# EAGLE design Week05_ElectronicsDesign_ADLL_FabAcademy2014 (EAGLE 6.5.0)
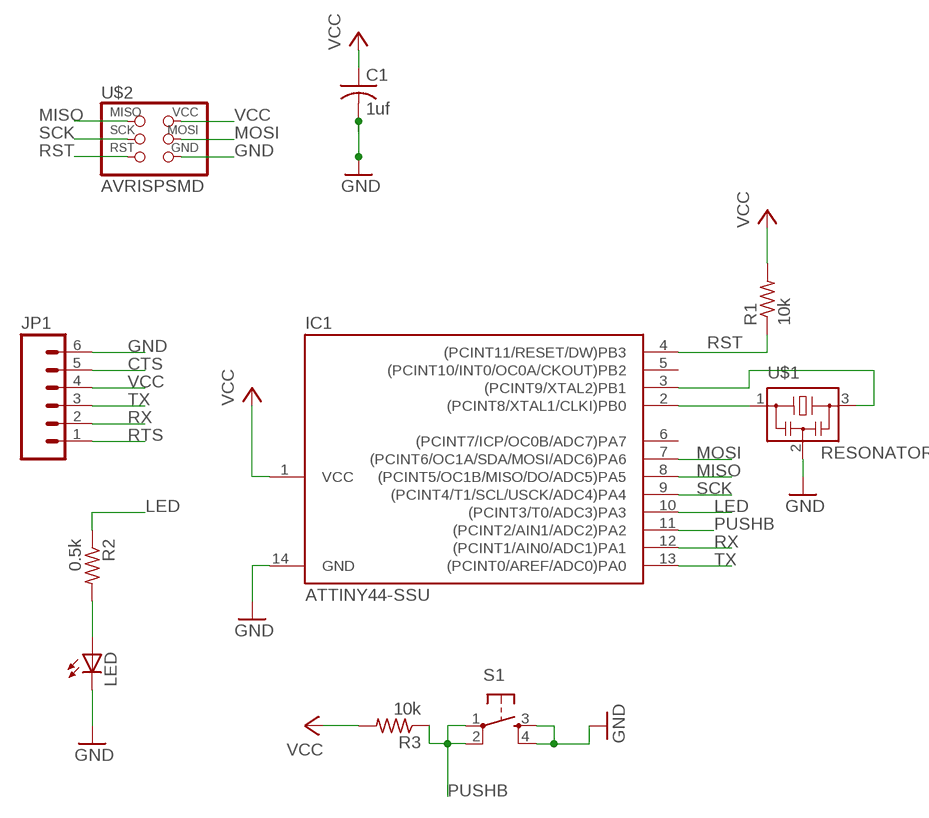
[diagram p0: schematic, sheet 1]

## Parts
C1  1uf  C-USC1206  [C1206]
IC1  ATTINY44-SSU  [SOIC14]
JP1  M06SMD  [1X06-SMD]
LED  LED1206  [1206]
R1  10k  R-US_R1206  [R1206]
R2  0.5k  R-US_R1206  [R1206]
R3  10k  R-US_R1206  [R1206]
S1  6MM_SWITCH6MM_SWITCH  [6MM_SWITCH]
U$1  RESONATOR  [EFOBM]
U$2  AVRISPSMD  [2X03SMD]

## Nets
CTS: JP1.5
GND: C1.2 IC1.14(GND) JP1.6 LED.2(C) S1.3(S) S1.4(S1) U$1.2 U$2.6(GND)
LED: IC1.10((PCINT3/T0/ADC3)PA3) R2.1
MISO: IC1.8((PCINT5/OC1B/MISO/DO/ADC5)PA5) U$2.1(MISO)
MOSI: IC1.7((PCINT6/OC1A/SDA/MOSI/ADC6)PA6) U$2.4(MOSI)
N$1: IC1.2((PCINT8/XTAL1/CLKI)PB0) U$1.1
N$2: IC1.3((PCINT9/XTAL2)PB1) U$1.3
N$3: LED.1(A) R2.2
PUSHB: IC1.11((PCINT2/AIN1/ADC2)PA2) R3.1 S1.1(P) S1.2(P1)
RST: IC1.4((PCINT11/RESET/DW)PB3) R1.1 U$2.5(RST)
RTS: JP1.1
RX: IC1.12((PCINT1/AIN0/ADC1)PA1) JP1.2
SCK: IC1.9((PCINT4/T1/SCL/USCK/ADC4)PA4) U$2.3(SCK)
TX: IC1.13((PCINT0/AREF/ADC0)PA0) JP1.3
VCC: C1.1 IC1.1(VCC) JP1.4 R1.2 R3.2 U$2.2(VCC)
Unconnected: IC1.5((PCINT10/INT0/OC0A/CKOUT)PB2) IC1.6((PCINT7/ICP/OC0B/ADC7)PA7)

## Library data of the parts
C1 = rcl:C-US: CAPACITOR, American symbol
IC1 = fab:ATTINY44
JP1 = SparkFun:M06: Header 6 Standard 6-pin 0.1" header. Use with straight break away headers (SKU : PRT-00116), right angle break away headers (PRT-00553), swiss pins (PRT-00743), machine pins (PRT-00117), and female headers (PRT-00115). Molex polarized connector foot print use with SKU : PRT-08094 with associated crimp pins and housings. NOTES ON THE VARIANTS LOCK and LOCK_LONGPADS... This footprint was designed to help hold the alignment of a through-hole component (i.e. 6-pin header) while soldering it into place. You may notice that each hole has been shifted either up or down by 0.005 of an inch from it's more standard position (which is a perfectly straight line). This slight alteration caused the pins (the squares in the middle) to touch the edges of the holes. Because they are alternating, it causes a "brace" to hold the component in place. 0.005 has proven to be the perfect amount of "off-center" position when using our standard breakaway headers. Although looks a little odd when you look at the bare footprint, once you have a header in there, the alteration is very hard to notice. Also, if you push a header all the way into place, it is covered up entirely on the bottom side. This idea of altering the position of holes to aid alignment will be further integrated into the Sparkfun Library for other footprints. It can help hold any component with 3 or more connection pins.
LED = 01_FAB_Hello:LED
R1-R3 = resistor:R-US_: RESISTOR, American symbol
S1 = 01_FAB_Hello:6MM_SWITCH: OMRON SWITCH
U$1 = fab:RESONATOR
U$2 = fab:AVRISP

## Board
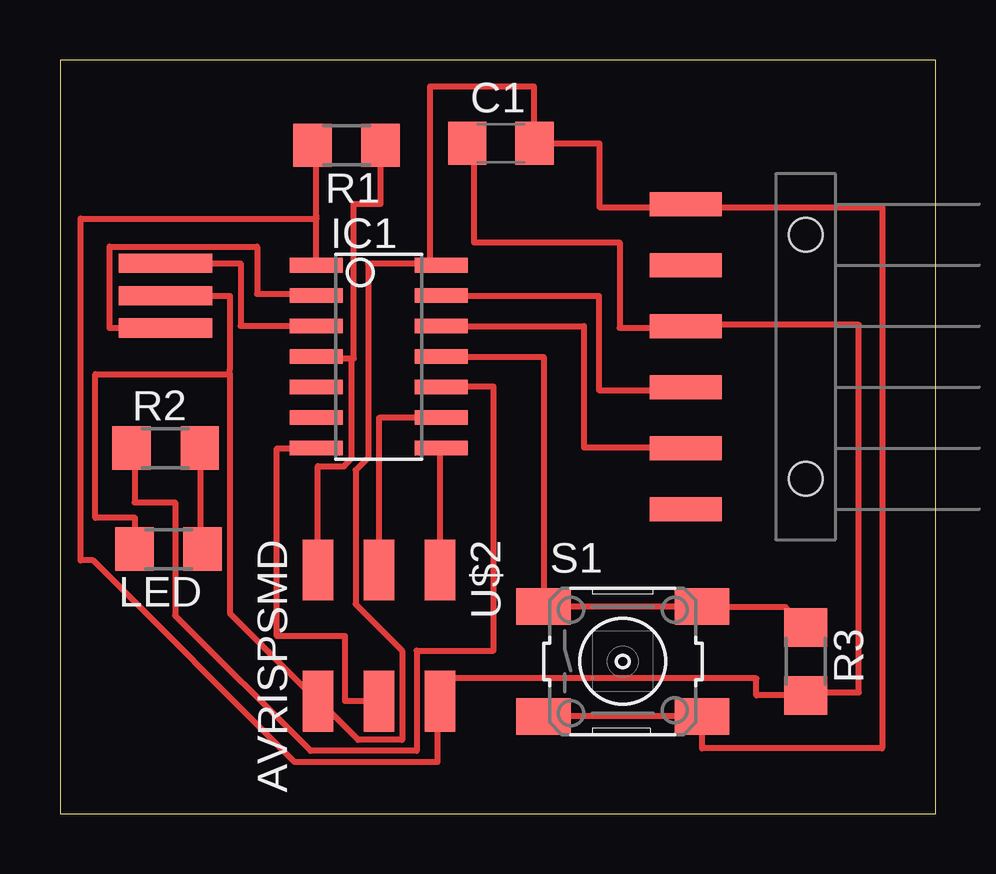
[diagram p1: board, top side]

Size 36.48 x 31.41 mm. Coordinates in mm from the lower left corner, seen from the top.
Outline: 0.01,0 36.48,0 36.48,31.41 0,31.41 0.01,0
Copper layers (1*16): Top 0.035mm / dielectric 1.5mm / Bottom 0.035mm
Design rules "default": minimum track width 10mil, minimum drill 24mil, track to track 8mil, track to pad 8mil, pad to pad 8mil, via to via 8mil, smd to smd 8mil, copper to edge 40mil, drill to drill 8mil, minimum pad ring 10mil, minimum via ring 8mil, stop-mask expansion 4mil, vias tented up to drill 0mil, thermal gap 10mil

### Footprints (pad centres in the part's own frame; a part is rotated, then mirrored left to right if it is on the bottom)
C1206 = smd 1.6 x 1.8: 1 -1.4,0; 2 1.4,0
SOIC14 = smd 0.61 x 2.21: 1 -3.81,-2.603; 2 -2.54,-2.603; 3 -1.27,-2.603; 4 0,-2.603; 5 1.27,-2.603; 6 2.54,-2.603; 7 3.81,-2.603; 8 3.81,2.603; 9 2.54,2.603; 10 1.27,2.603; 11 0,2.603; 12 -1.27,2.603; 13 -2.54,2.603; 14 -3.81,2.603
1X06-SMD = smd 1 x 3: 1 -6.35,5; 2 -3.81,5; 3 -1.27,5; 4 1.27,5; 5 3.81,5; 6 6.35,5 | hole 1.4: -5.08,0; 5.08,0
1206 = smd 1.6 x 1.803: 1 -1.422,0; 2 1.422,0
R1206 = smd 1.6 x 1.803: 1 -1.422,0; 2 1.422,0
6MM_SWITCH = smd 2.286 x 1.524: 1 -3.302,2.286; 2 3.302,2.286; 3 -3.302,-2.286; 4 3.302,-2.286
EFOBM = smd 0.8 x 3.9: 1 -1.35,0; 2 0,0; 3 1.35,0
2X03SMD = smd 2.54 x 1.27: 1 -2.54,2.54; 2 2.92,2.54; 3 -2.54,0; 4 2.92,0; 5 -2.54,-2.54; 6 2.92,-2.54

### Placement (x,y rotation side)
C1  18.37,27.94 0 top
IC1  13.29,19.05 270 top
JP1  31.07,19.05 90 top
LED  4.52,11.03 180 top
R1  11.94,27.86 180 top
R2  4.4,15.24 0 top
R3  31.07,6.35 270 top
S1  23.45,6.35 0 top
U$1  4.4,21.59 90 top
U$2  13.29,7.62 270 top

### Tracks (layer width: path | path; a pad name or v marks a point on that pad's centre or on a via)
GND
  Top 0.254: LED.2 3.08,11.04 3.13,11.04 3.13,12.33 1.47,12.33 1.47,18.32 7.08,18.32 | U$1.2 7.08,21.58 7.08,18.53 7.08,18.32 | S1.3 S1.4 | IC1.14 15.82,22.92 15.41,22.92 | 26.88,4.04 S1.4 | S1.4 26.75,2.73 34.25,2.73 34.25,25.28 26.12,25.28 JP1.6 26.07,25.28 22.47,25.28 22.47,27.94 C1.2 19.72,28.06 19.75,28.06 19.75,30.3 15.41,30.3 15.41,22.92 | 7.08,18.32 7.08,8.36 U$2.6 10.86,4.64 12.42,3.08 14.26,3.08 14.26,6.8 12.32,8.74 12.32,14.32 12.84,14.84 12.84,22.92 15.41,22.92
LED
  Top 0.254: IC1.10 16.52,17.78 16.52,17.8 18.07,17.8 18.07,6.8 14.86,6.8 14.86,2.62 10.44,2.62 4.8,8.26 4.8,12.98 3.11,12.98 3.11,15.24 R2.1
MISO
  Top 0.254: IC1.8 15.84,15.2 U$2.1
MOSI
  Top 0.254: IC1.7 9.04,15.23 9.04,7.4 11.88,7.4 11.88,4.7 U$2.4
N$1
  Top 0.254: U$1.1 2.07,20.24 2.07,23.63 8.21,23.63 8.21,21.67 10.69,21.67 IC1.2
N$2
  Top 0.254: IC1.3 7.53,20.33 7.53,22.94 U$1.3
N$3
  Top 0.254: LED.1 5.84,11.14 5.84,15.24 R2.2
PUSHB
  Top 0.254: R3.1 30.22,8.62 26.76,8.62 S1.2 26.62,8.64 20.28,8.64 S1.1 | IC1.11 20.15,19.04 S1.1 | S1.1
RST
  Top 0.254: 12.14,18.98 12.14,14.8 11.86,14.52 11.86,14.49 10.74,14.49 U$2.5 | IC1.4 11.4,18.98 12.14,18.98 | 12.14,18.98 12.24,18.98 12.24,25.42 13.36,25.42 R1.1
RX
  Top 0.254: JP1.2 26.07,15.27 21.83,15.27 21.83,20.32 IC1.12
SCK
  Top 0.254: IC1.9 13.3,16.5 U$2.3
TX
  Top 0.254: IC1.13 22.45,21.58 22.45,17.66 26.07,17.66 JP1.3
VCC
  Top 0.254: 10.68,24.8 IC1.1 | R1.2 10.68,27.7 10.68,24.91 10.68,24.8 | 15.84,5.16 U$2.2 | U$2.2 15.72,4.64 15.72,2.16 9.78,2.16 1.38,10.56 0.86,10.56 0.86,24.8 10.68,24.8 | 26.12,20.2 JP1.4 | C1.1 17.24,27.94 17.24,23.81 23.32,23.81 23.32,20.25 26.07,20.25 JP1.4 | JP1.4 26.07,20.37 33.29,20.37 33.29,5.06 31.12,5.06 R3.2 29.02,4.94 29.02,5.64 15.88,5.64 15.88,5.66 15.83,5.66 U$2.2